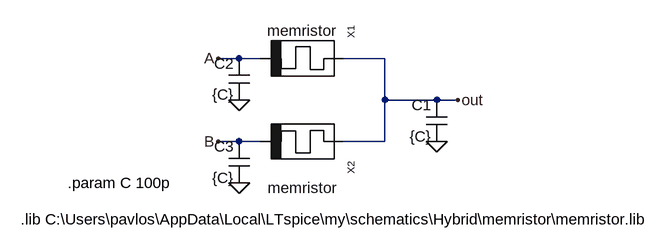
[diagram p0: schematic and.asc]
and.asc, the LTspice schematic file:
Version 4
SHEET 1 880 680
WIRE -336 -448 -368 -448
WIRE -304 -448 -336 -448
WIRE -112 -448 -176 -448
WIRE -112 -384 -112 -448
WIRE -32 -384 -112 -384
WIRE 0 -384 -32 -384
WIRE -336 -320 -368 -320
WIRE -304 -320 -336 -320
WIRE -112 -320 -112 -384
WIRE -112 -320 -176 -320
FLAG 0 -384 out
FLAG -368 -448 A
FLAG -368 -320 B
FLAG -32 -320 0
FLAG -336 -384 0
FLAG -336 -256 0
SYMBOL cap -16 -384 M0
SYMATTR InstName C1
SYMATTR Value {C}
SYMBOL memristor -240 -448 M270
WINDOW 3 58 -1 VBottom 2
WINDOW 39 79 -4 VBottom 2
SYMATTR InstName X1
SYMBOL memristor -240 -320 R90
WINDOW 3 56 -2 VTop 2
WINDOW 39 82 4 VTop 2
SYMATTR InstName X2
SYMBOL cap -320 -448 M0
SYMATTR InstName C2
SYMATTR Value {C}
SYMBOL cap -320 -320 M0
SYMATTR InstName C3
SYMATTR Value {C}
TEXT -672 -200 Left 2 !.lib C:\\Users\\pavlos\\AppData\\Local\\LTspice\\my\\schematics\\Hybrid\\memristor\\memristor.lib
TEXT -600 -256 Left 2 !.param C 100p

The netlist it stands for:
* and.asc
C1 out 0 {C}
XX1 out A memristor  ; pins plus minus
XX2 out B memristor  ; pins plus minus
C2 A 0 {C}
C3 B 0 {C}
.lib C:\Users\pavlos\AppData\Local\LTspice\my\schematics\Hybrid\memristor\memristor.lib
.param C 100p
.backanno
.end